# EAGLE schematic Schematic1 v20 (EAGLE 9.7.0)
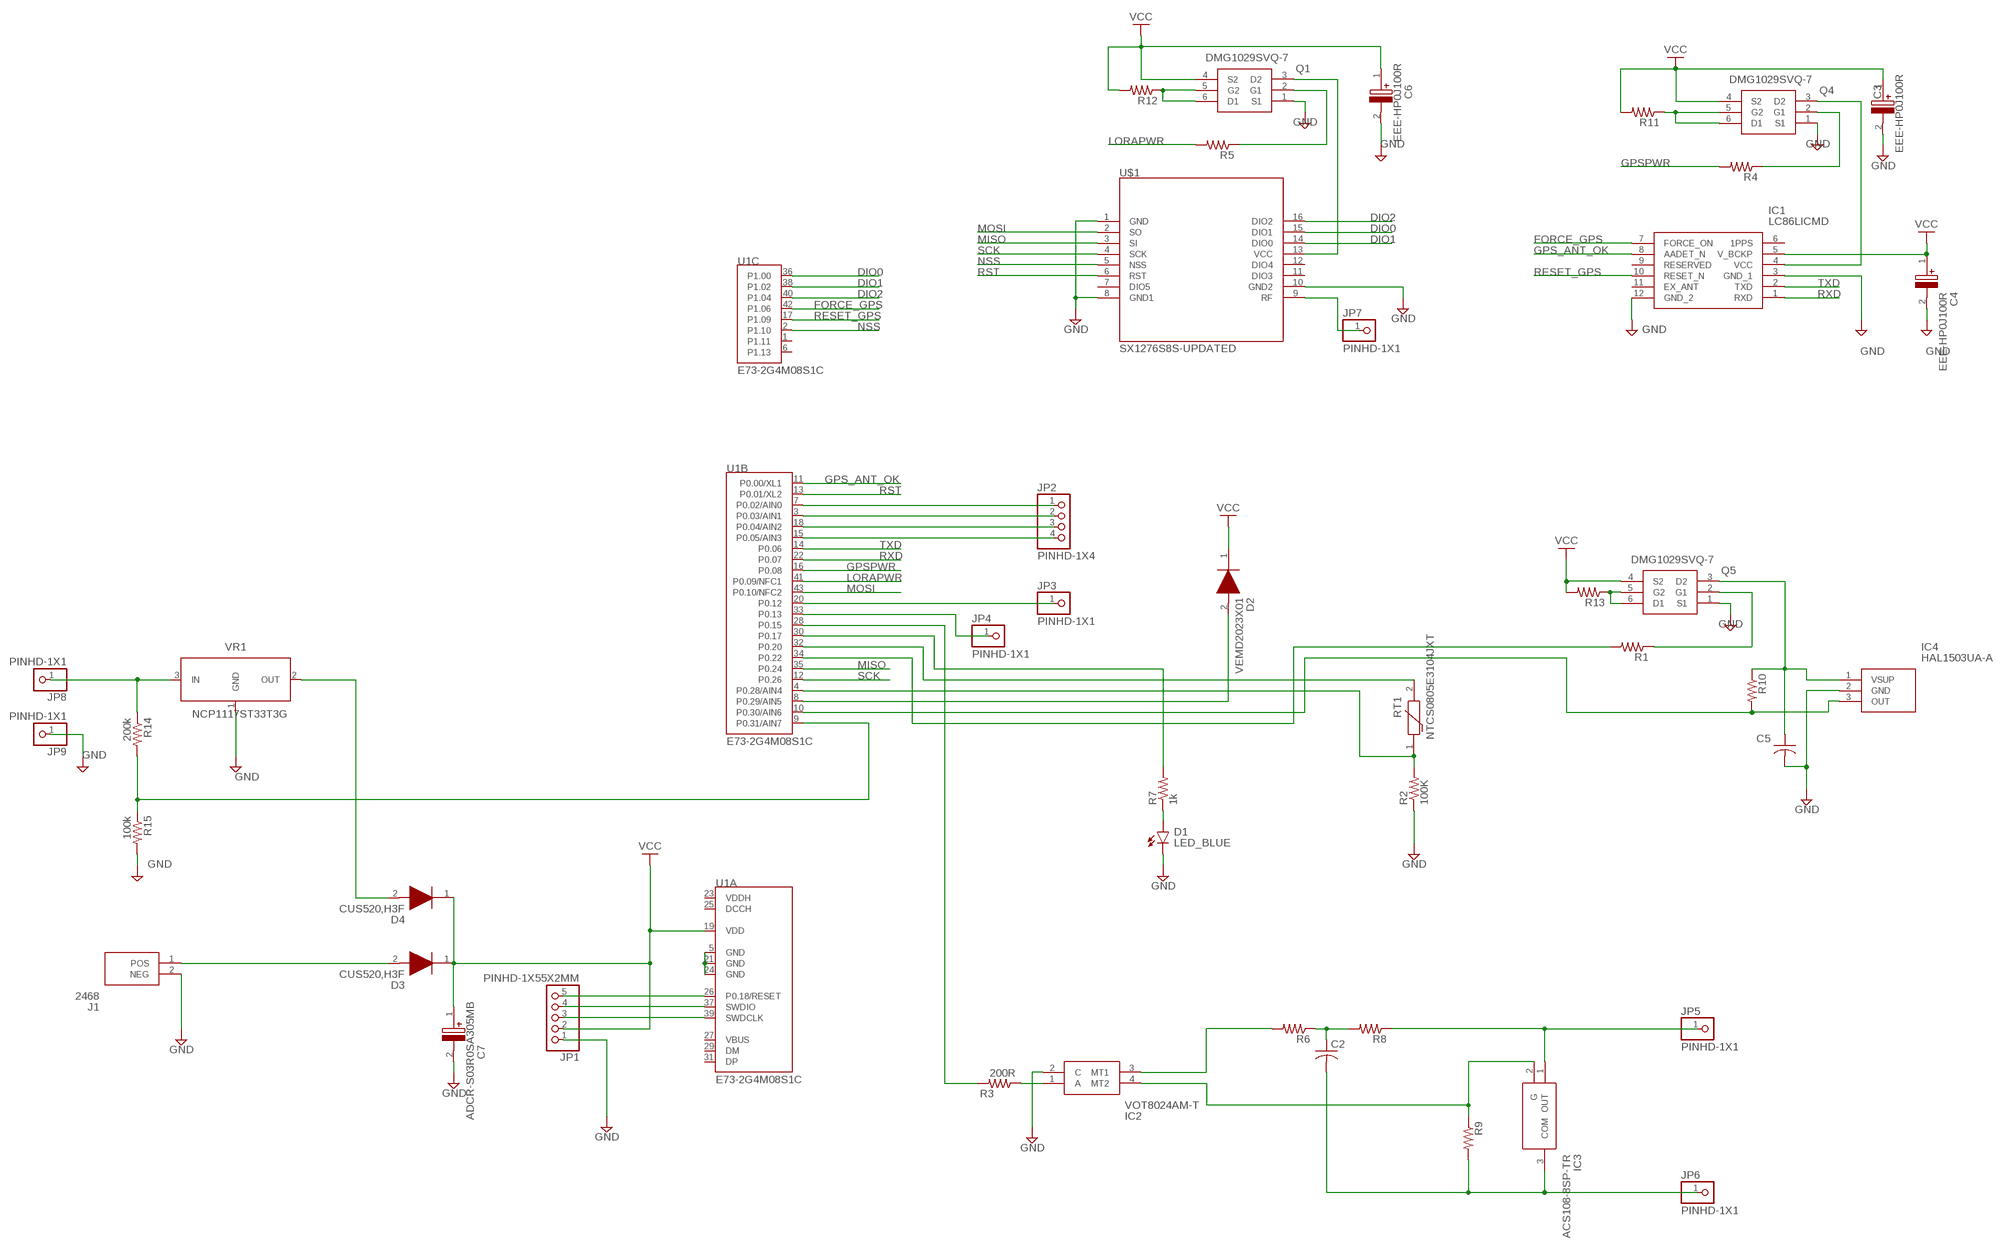
[diagram p0: schematic, sheet 1]

## Parts
C2  C-US_CHIP-0805(2012-METRIC)  [CAPC2012X110]
C3  EEE-HP0J100R  [CAPAE430X610N]
C4  EEE-HP0J100R  [CAPAE430X610N]
C5  C-US_CHIP-0805(2012-METRIC)  [CAPC2012X110]
C6  EEE-HP0J100R  [CAPAE430X610N]
C7  ADCR-S03R0SA305MB  [CAPPRD350W65D800H2000]
D1  LED_BLUE  CHIP-FLAT-B_0402  [LEDC1005X25N_FLAT-B]
D2  VEMD2023X01  [VEMD2023X01]
D3  CUS520,H3F  [SOD2513X115N]
D4  CUS520,H3F  [SOD2513X115N]
IC1  LC86LICMD  [LC86LICMD]
IC2  VOT8024AM-T  [SOP254P675X240-4N]
IC3  ACS108-8SP-TR  [ACS1088SPTR]
IC4  HAL1503UA-A  [HAL1503UAA]
J1  2468  [2468]
JP1  PINHD-1X55X2MM  [1_05X2MM]
JP2  PINHD-1X4  [1X04]
JP3  PINHD-1X1  [1X01]
JP4  PINHD-1X1  [1X01]
JP5  PINHD-1X1  [1X01]
JP6  PINHD-1X1  [1X01]
JP7  PINHD-1X1  [1X01]
JP8  PINHD-1X1  [1X01]
JP9  PINHD-1X1  [1X01]
Q1  DMG1029SVQ-7  [DMG1029SVQ7]
Q4  DMG1029SVQ-7  [DMG1029SVQ7]
Q5  DMG1029SVQ-7  [DMG1029SVQ7]
R1  R-US_CHIP-0805(2012-METRIC)  [RESC2012X65]
R2  100K  R-US_CHIP-0805(2012-METRIC)  [RESC2012X65]
R3  200R  R-US_CHIP-0805(2012-METRIC)  [RESC2012X65]
R4  R-US_CHIP-0805(2012-METRIC)  [RESC2012X65]
R5  R-US_CHIP-0805(2012-METRIC)  [RESC2012X65]
R6  R-US_CHIP-0805(2012-METRIC)  [RESC2012X65]
R7  1k  R-US_CHIP-0805(2012-METRIC)  [RESC2012X65]
R8  R-US_CHIP-0805(2012-METRIC)  [RESC2012X65]
R9  R-US_CHIP-0805(2012-METRIC)  [RESC2012X65]
R10  R-US_CHIP-0805(2012-METRIC)  [RESC2012X65]
R11  R-US_CHIP-0805(2012-METRIC)  [RESC2012X65]
R12  R-US_CHIP-0805(2012-METRIC)  [RESC2012X65]
R13  R-US_CHIP-0805(2012-METRIC)  [RESC2012X65]
R14  200k  R-US_CHIP-0805(2012-METRIC)  [RESC2012X65]
R15  100k  R-US_CHIP-0805(2012-METRIC)  [RESC2012X65]
RT1  NTCS0805E3104JXT  [THRMC2012X95N]
U1  E73-2G4M08S1C  [E73-2G4M08S1C]
U$1  SX1276S8S-UPDATED  [FP-SX1726-MOD]
VR1  NCP1117ST33T3G  NCP1117ST33T3GSOT-223  [SOT230P700X170-4]

## Nets
DIO0: U1.36(C:P1.00) U$1.15(DIO1)
DIO1: U1.38(C:P1.02) U$1.14(DIO0)
DIO2: U1.40(C:P1.04) U$1.16(DIO2)
FORCE_GPS: IC1.7(FORCE_ON) U1.42(C:P1.06)
GND: C3.2(-) C4.2(-) C5.2 C6.2(-) C7.2(-) D1.C IC1.3(GND_1) IC1.12(GND_2) IC2.2(C) IC4.2(GND) J1.2(NEG) JP1.1 JP9.1 Q1.1(S1) Q4.1(S1) Q5.1(S1) R2.1 R15.2 U$1.1(GND) U$1.8(GND1) U$1.10(GND2) VR1.1(GND)
GPS_ANT_OK: IC1.8(AADET_N) U1.11(B:P0.00/XL1)
GPSPWR: R4.2 U1.16(B:P0.08)
LORAPWR: R5.2 U1.41(B:P0.09/NFC1)
MISO: U1.35(B:P0.24) U$1.3(SI)
MOSI: U1.43(B:P0.10/NFC2) U$1.2(SO)
N$1: Q1.3(D2) U$1.13(VCC)
N$2: Q1.2(G1) R5.1
N$3: Q4.5(G2) Q4.6(D1) R11.1
N$4: IC1.4(VCC) Q4.3(D2)
N$5: R2.2 RT1.1 U1.4(B:P0.28/AIN4)
N$6: JP1.5 U1.26(A:P0.18/RESET)
N$7: D1.A R7.1
N$8: JP1.4 U1.37(A:SWDIO)
N$9: JP1.3 U1.39(A:SWDCLK)
N$10: JP2.1 U1.7(B:P0.02/AIN0)
N$11: JP2.2 U1.3(B:P0.03/AIN1)
N$12: JP2.3 U1.18(B:P0.04/AIN2)
N$13: JP2.4 U1.15(B:P0.05/AIN3)
N$14: JP3.1 U1.20(B:P0.12)
N$15: JP4.1 U1.33(B:P0.13)
N$16: IC2.1(A) R3.1
N$17: D2.2(A) U1.8(B:P0.29/AIN5)
N$18: R3.2 U1.28(B:P0.15)
N$19: R7.2 U1.30(B:P0.17)
N$20: RT1.2 U1.32(B:P0.20)
N$21: C2.1 R6.1 R8.2
N$22: IC2.4(MT2) IC3.2(G) R9.1
N$23: C2.2 IC3.3(COM) JP6.1 R9.2
N$24: IC3.1(OUT) JP5.1 R8.1
N$25: IC2.3(MT1) R6.2
N$26: C5.1 IC4.1(VSUP) Q5.3(D2) R10.1
N$27: Q5.2(G1) R1.1
N$28: IC4.3(OUT) R10.2 U1.10(B:P0.30/AIN6)
N$29: R1.2 U1.34(B:P0.22)
N$30: Q4.2(G1) R4.1
N$31: Q1.5(G2) Q1.6(D1) R12.1
N$32: Q5.5(G2) Q5.6(D1) R13.1
N$33: R14.2 R15.1 U1.9(B:P0.31/AIN7)
N$34: U1.5(A:GND) U1.21(A:GND) U1.24(A:GND)
N$35: D3.2(A) J1.1(POS)
N$36: JP8.1 R14.1 VR1.3(IN)
N$37: JP7.1 U$1.9(RF)
N$38: D4.2(A) VR1.2(OUT)
NSS: U1.2(C:P1.10) U$1.5(NSS)
RESET_GPS: IC1.10(RESET_N) U1.17(C:P1.09)
RST: U1.13(B:P0.01/XL2) U$1.6(RST)
RXD: IC1.1(RXD) U1.22(B:P0.07)
SCK: U1.12(B:P0.26) U$1.4(SCK)
TXD: IC1.2(TXD) U1.14(B:P0.06)
VCC: C3.1(+) C4.1(+) C6.1(+) C7.1(+) D2.1(K) D3.1(K) D4.1(K) IC1.5(V_BCKP) JP1.2 Q1.4(S2) Q4.4(S2) Q5.4(S2) R11.2 R12.2 R13.2 U1.19(A:VDD)
Unconnected: IC1.6(1PPS) IC1.9(RESERVED) IC1.11(EX_ANT) U1.1(C:P1.11) U1.6(C:P1.13) U1.23(A:VDDH) U1.25(A:DCCH) U1.27(A:VBUS) U1.29(A:DM) U1.31(A:DP) U$1.7(DIO5) U$1.11(DIO3) U$1.12(DIO4)

## Library data of the parts
C2 C5 = Capacitor:C-US: Capacitor - ANSI; CATEGORY: Capacitor
C3 C4 C6 = EEE-HP0J100R:EEE-HP0J100R: Aluminum Electrolytic Capacitors - SMD Al Lytic Cap 105C SMT BP-HB Series Source: Datasheet <https://industrial.panasonic.com/cdbs/www-data/pdf/RDE0000/ABA0000C1157.pdf>; DESCRIPTION: Aluminum Electrolytic Capacitors - SMD Al Lytic Cap 105C SMT BP-HB Series; HEIGHT: 6.1mm; MANUFACTURER_NAME: Panasonic; MANUFACTURER_PART_NUMBER: EEE-HP0J100R; MOUSER_PART_NUMBER: 667-EEE-HP0J100R; MOUSER_PRICE-STOCK: https://www.mouser.co.uk/ProductDetail/Panasonic/EEE-HP0J100R?qs=GoZnPdyRfjb6sZlAqWVWuQ%3D%3D
C7 = ADCR-S03R0SA305MB:ADCR-S03R0SA305MB: CAP 3F 3V TH Source: Datasheet <https://abracon.com/datasheets/ADCR-S03R0S.pdf>; DESCRIPTION: CAP 3F 3V TH; HEIGHT: 20mm; MANUFACTURER_NAME: ABRACON; MANUFACTURER_PART_NUMBER: ADCR-S03R0SA305MB; MOUSER_PART_NUMBER: 815-ADCRS03R0SA305MB; MOUSER_PRICE-STOCK: https://www.mouser.co.uk/ProductDetail/ABRACON/ADCR-S03R0SA305MB?qs=11PymoJGorJFz5koTqmlDw%3D%3D
D1 = LED:CHIP-FLAT-B; CATEGORY: LED; COLOR: BLUE; DESCRIPTION: CHIP LED FLAT; SUB-CATEGORY: CHIP; TYPE: FLAT_TOP
D2 = VEMD2023X01:VEMD2023X01: Photodiodes Gullwing 750-1050nm +/-35 deg Source: Datasheet <https://componentsearchengine.com/Datasheets/2/VEMD2023X01.pdf>; DESCRIPTION: Photodiodes Gullwing 750-1050nm +/-35 deg; HEIGHT: 2.7mm; MANUFACTURER_NAME: Vishay; MANUFACTURER_PART_NUMBER: VEMD2023X01; MOUSER_PART_NUMBER: 78-VEMD2023X01; MOUSER_PRICE-STOCK: https://www.mouser.co.uk/ProductDetail/Vishay-Semiconductors/VEMD2023X01?qs=5csRq1wdUj7rHVLzT8%252Bxcw%3D%3D
D3 D4 = CUS520_H3F:CUS520,H3F: Schottky Diodes & Rectifiers Single Low Leakge Source: Datasheet <https://toshiba.semicon-storage.com/info/docget.jsp?did=7041&prodName=CUS520>; DESCRIPTION: Schottky Diodes & Rectifiers Single Low Leakge; HEIGHT: 1.15mm; MANUFACTURER_NAME: Toshiba; MANUFACTURER_PART_NUMBER: CUS520,H3F; MOUSER_PART_NUMBER: 757-CUS520H3F; MOUSER_PRICE-STOCK: https://www.mouser.co.uk/ProductDetail/Toshiba/CUS520H3F?qs=cW4DzVrAanMh8DRQGiUcZw%3D%3D
IC1 = LC86LICMD:LC86LICMD: Quectel Wireless Solutions Source: Datasheet <https://cdn.sos.sk/productdata/39/c0/eb20bda6/lc86l.pdf>; DESCRIPTION: Quectel Wireless Solutions; HEIGHT: 7.05mm; MANUFACTURER_NAME: Quectel; MANUFACTURER_PART_NUMBER: LC86LICMD; MOUSER_PART_NUMBER: 277-LC86LICMD; MOUSER_PRICE-STOCK: https://www.mouser.co.uk/ProductDetail/Quectel/LC86LICMD?qs=iLbezkQI%252BsiFPFQjIwBL1Q%3D%3D
IC2 = VOT8024AM-T:VOT8024AM-T: Triac & SCR Output Optocouplers 800V Vrdm Phototriac SOP-4; UL, cUL Source: Datasheet <https://www.vishay.com/docs/84909/vot8024am.pdf>; DESCRIPTION: Triac & SCR Output Optocouplers 800V Vrdm Phototriac SOP-4; UL, cUL; HEIGHT: 2.4mm; MANUFACTURER_NAME: Vishay; MANUFACTURER_PART_NUMBER: VOT8024AM-T; MOUSER_PART_NUMBER: 78-VOT8024AM-T; MOUSER_PRICE-STOCK: https://www.mouser.co.uk/ProductDetail/Vishay-Semiconductors/VOT8024AM-T?qs=byeeYqUIh0N%252Bs3wUufxnOA%3D%3D
IC3 = ACS108-8SP-TR:ACS108-8SP-TR: Overvoltage protected AC Switch 0.8 A - 800 V in SOT223-2L high creepage package Source: Datasheet <https://www.st.com/resource/en/datasheet/acs108-8sp.pdf>; DESCRIPTION: Overvoltage protected AC Switch 0.8 A - 800 V in SOT223-2L high creepage package; HEIGHT: 1.8mm; MANUFACTURER_NAME: STMicroelectronics; MANUFACTURER_PART_NUMBER: ACS108-8SP-TR; MOUSER_PART_NUMBER: 511-ACS108-8SP-TR; MOUSER_PRICE-STOCK: https://www.mouser.co.uk/ProductDetail/STMicroelectronics/ACS108-8SP-TR?qs=pBunHO6%252BwtF6H7n0e1joeA%3D%3D
IC4 = HAL1503UA-A:HAL1503UA-A: Board Mount Hall Effect / Magnetic Sensors Source: Datasheet <https://product.tdk.com/system/files/dam/doc/product/sensor/switch/hall-switch/data_sheet/hal_15xy_hall-effect_switches_with_open-drain_output_3-wire_in_to92_package.pdf>; DESCRIPTION: Board Mount Hall Effect / Magnetic Sensors; HEIGHT: 4.4mm; MANUFACTURER_NAME: TDK; MANUFACTURER_PART_NUMBER: HAL1503UA-A; MOUSER_PART_NUMBER: 586-HAL1503UA-A; MOUSER_PRICE-STOCK: https://www.mouser.co.uk/ProductDetail/TDK-Micronas/HAL1503UA-A?qs=u%2FaXZZupywzQZMZFxYZolA%3D%3D
J1 = 2468:2468: Cylindrical Battery Contacts, Clips, Holders & Springs 2AAA PC MNT HOLDER Source: Datasheet <https://datasheet.datasheetarchive.com/originals/distributors/Datasheets-AE/DSA3AE00005.pdf>; DESCRIPTION: Cylindrical Battery Contacts, Clips, Holders & Springs 2AAA PC MNT HOLDER; HEIGHT: mm; MANUFACTURER_NAME: Keystone Electronics; MANUFACTURER_PART_NUMBER: 2468; MOUSER_PART_NUMBER: 534-2468; MOUSER_PRICE-STOCK: https://www.mouser.co.uk/ProductDetail/Keystone-Electronics/2468?qs=3CbvriavsLAoISGi3MywrQ%3D%3D
JP1 = Connector:PINHD-1X5: PIN HEADER; CATEGORY: Headers; DESCRIPTION: Header, Straight, 5 Position; MANUFACTURER: Generic; MPN: Generic; OPERATING_TEMPERATURE: Generic; PART_STATUS: Active; PITCH: 0.079" (2.00mm); ROHS_COMPLIANCE: Generic; SERIES: Generic; SUB-CATEGORY: Headers, Male Pins; TYPE: Board to Board or Cable, Unshrouded, Through Hole, Straight
JP2 = Connector:PINHD-1X4: PIN HEADER; CATEGORY: Headers; DESCRIPTION: Header, Straight, 4 Position; MANUFACTURER: Generic; MPN: Generic; OPERATING_TEMPERATURE: Generic; PART_STATUS: Active; PITCH: 0.100" (2.54mm); ROHS_COMPLIANCE: Generic; SERIES: Generic; SUB-CATEGORY: Headers, Male Pins; TYPE: Board to Board or Cable, Unshrouded, Through Hole, Straight
JP3-JP9 = Connector:PINHD-1X1: PIN HEADER; CATEGORY: Headers; DESCRIPTION: Header, Straight, 1 Position; MANUFACTURER: Generic; MPN: Generic; OPERATING_TEMPERATURE: Generic; PART_STATUS: Active; PITCH: 0.100" (2.54mm); ROHS_COMPLIANCE: Generic; SERIES: Generic; SUB-CATEGORY: Headers, Male Pins; TYPE: Board to Board or Cable, Unshrouded, Through Hole, Straight
Q1 Q4 Q5 = DMG1029SVQ-7:DMG1029SVQ-7: Mosfet Array 60V 500mA (Ta), 360mA (Ta) 450mW (Ta) Surface Mount SOT-563 Source: Datasheet <https://www.diodes.com//assets/Datasheets/DMG1029SVQ.pdf>; DESCRIPTION: Mosfet Array 60V 500mA (Ta), 360mA (Ta) 450mW (Ta) Surface Mount SOT-563; HEIGHT: 0.6mm; MANUFACTURER_NAME: Diodes Incorporated; MANUFACTURER_PART_NUMBER: DMG1029SVQ-7; MOUSER_PART_NUMBER: 621-DMG1029SVQ-7; MOUSER_PRICE-STOCK: https://www.mouser.co.uk/ProductDetail/Diodes-Incorporated/DMG1029SVQ-7?qs=u16ybLDytRbBaAc3KwCTwA%3D%3D
R1-R15 = Tutorial - Fusion 360:R-US: Resistor Fixed - ANSI; CATEGORY: Resistor; SUB-CATEGORY: Fixed
RT1 = NTCS0805E3104JXT:NTCS0805E3104JXT: NTC Thermistors 100Kohms 5% SMD Source: Datasheet <http://www.vishay.com/docs/29044/ntcs0805e3t.pdf>; DESCRIPTION: NTC Thermistors 100Kohms 5% SMD; HEIGHT: 0.95mm; MANUFACTURER_NAME: Vishay; MANUFACTURER_PART_NUMBER: NTCS0805E3104JXT; MOUSER_PART_NUMBER: 594-NTCS0805E3104JXT; MOUSER_PRICE-STOCK: https://www.mouser.co.uk/ProductDetail/Vishay-BC-Components/NTCS0805E3104JXT?qs=Y0gyZw6qHXedwsSst0X8tA%3D%3D
U1 = E73-2G4M08S1C:E73-2G4M08S1C: Check availability <https://pricing.snapeda.com/parts/E73-2G4M08S1C/EBYTE/view-part?ref=eda>; AVAILABILITY: Not in stock; CHECK_PRICES: https://www.snapeda.com/parts/E73-2G4M08S1C/EBYTE/view-part/?ref=eda; DESCRIPTION: E73 series are wireless Bluetooth modules designed by Chengdu Ebyte which feature small size, low power consumption, built-in PCB antenna and IPX interface; MF: EBYTE; MP: E73-2G4M08S1C; PACKAGE: Package; PRICE: None; SNAPEDA_LINK: https://www.snapeda.com/parts/E73-2G4M08S1C/EBYTE/view-part/?ref=snap
U$1 = Library:SX1276S8S-UPDATED
VR1 = IC_Power-Management:NCP1117ST33T3G: 1.0 A Low-Dropout Positive Fixed and Adjustable Voltage Regulators Datasheet <https://www.onsemi.com/pub/Collateral/NCP1117-D.PDF>; CATEGORY: IC_Power-Management; MANUFACTURER: ON Semiconductor; MPN: NCP1117ST33T3G; OPERATING_TEMP: 0 to +125 °C; PART_STATUS: Active; ROHS_COMPLIANT: RoHS3 Compliant; SERIES: NCP1117, NCV1117; SUB-CATEGORY: Voltage Regulator; TYPE: Linear